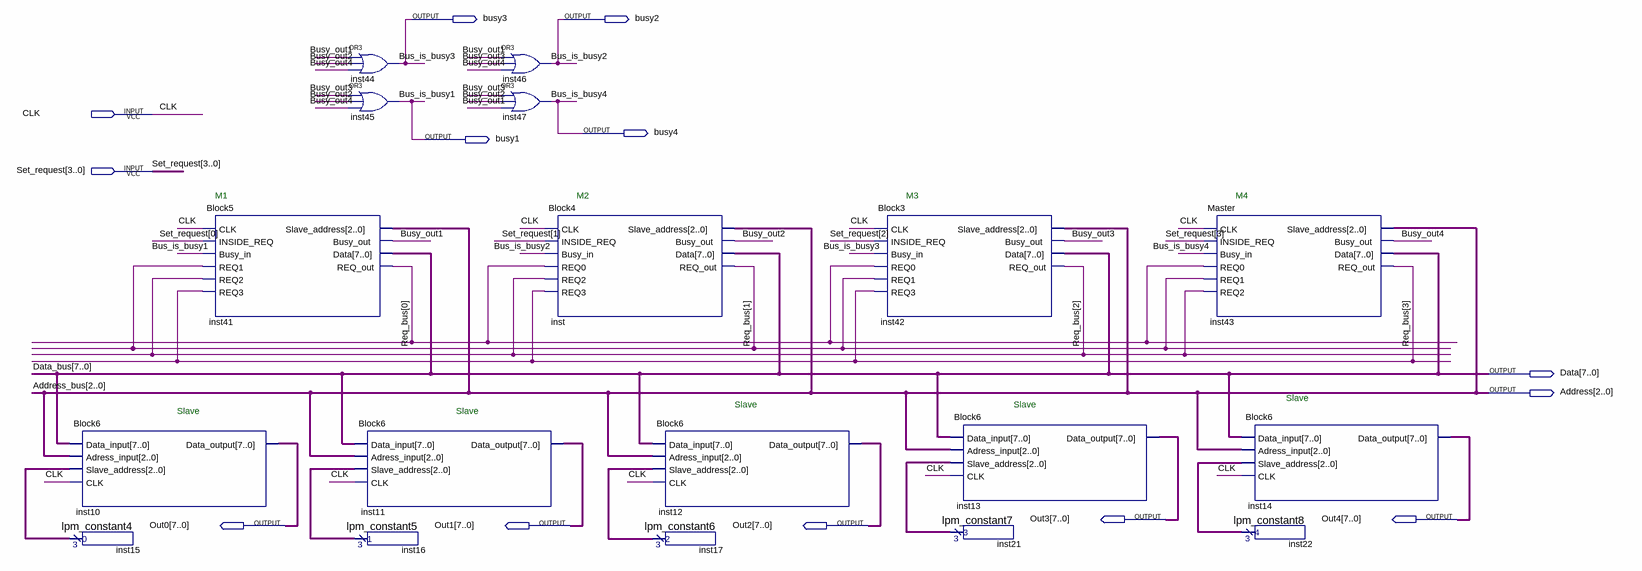
[diagram p0: schematic sheet]
// Quartus schematic Block7.bdf as structural Verilog: 18 symbols, 13 pins
module Block7 (
  input  CLK,
  input  [3:0] Set_request,
  output busy3,
  output busy2,
  output busy4,
  output busy1,
  output [7:0] Data,
  output [2:0] Address,
  output [7:0] Out3,
  output [7:0] Out4,
  output [7:0] Out0,
  output [7:0] Out1,
  output [7:0] Out2
);

  wire Busy_out1, Busy_out2, Busy_out3, Busy_out4;
  wire [2:0] inst15_result, inst16_result, inst17_result, inst21_result, inst22_result;
  wire [3:0] Req_bus;

  Block6 inst10 (
    .Data_input(Data), .Adress_input(Address), .Slave_address(inst15_result), .CLK(CLK), .Data_output(Out0));
  lpm_constant4 inst15 (.result(inst15_result));
  Block5 inst41 (
    .CLK(CLK), .INSIDE_REQ(Set_request[0]), .Busy_in(busy1), .REQ1(Req_bus[1]), .REQ2(Req_bus[2]),
    .REQ3(Req_bus[3]), .Slave_address(Address), .Busy_out(Busy_out1), .Data(Data), .REQ_out(Req_bus[0]));
  or inst44 (busy3, Busy_out1, Busy_out2, Busy_out4);
  or inst45 (busy1, Busy_out3, Busy_out2, Busy_out4);
  Block6 inst11 (
    .Data_input(Data), .Adress_input(Address), .Slave_address(inst16_result), .CLK(CLK), .Data_output(Out1));
  lpm_constant5 inst16 (.result(inst16_result));
  or inst46 (busy2, Busy_out1, Busy_out3, Busy_out4);
  or inst47 (busy4, Busy_out3, Busy_out2, Busy_out1);
  Block4 inst (
    .CLK(CLK), .INSIDE_REQ(Set_request[1]), .Busy_in(busy2), .REQ0(Req_bus[0]), .REQ2(Req_bus[2]),
    .REQ3(Req_bus[3]), .Slave_address(Address), .Busy_out(Busy_out2), .Data(Data), .REQ_out(Req_bus[1]));
  Block6 inst12 (
    .Data_input(Data), .Adress_input(Address), .Slave_address(inst17_result), .CLK(CLK), .Data_output(Out2));
  lpm_constant6 inst17 (.result(inst17_result));
  Block3 inst42 (
    .CLK(CLK), .INSIDE_REQ(Set_request[2]), .Busy_in(busy3), .REQ0(Req_bus[0]), .REQ1(Req_bus[1]),
    .REQ3(Req_bus[3]), .Slave_address(Address), .Busy_out(Busy_out3), .Data(Data), .REQ_out(Req_bus[2]));
  Block6 inst13 (
    .Data_input(Data), .Adress_input(Address), .Slave_address(inst21_result), .CLK(CLK), .Data_output(Out3));
  lpm_constant7 inst21 (.result(inst21_result));
  Master inst43 (
    .CLK(CLK), .INSIDE_REQ(Set_request[3]), .Busy_in(busy4), .REQ0(Req_bus[0]), .REQ1(Req_bus[1]),
    .REQ2(Req_bus[2]), .Slave_address(Address), .Busy_out(Busy_out4), .Data(Data), .REQ_out(Req_bus[3]));
  Block6 inst14 (
    .Data_input(Data), .Adress_input(Address), .Slave_address(inst22_result), .CLK(CLK), .Data_output(Out4));
  lpm_constant8 inst22 (.result(inst22_result));

  // Other names for the same wires on the sheet: Address_bus[2:0] = Address; Bus_is_busy4 = busy4;
  //   Bus_is_busy1 = busy1; Bus_is_busy2 = busy2; Bus_is_busy3 = busy3; Data_bus[7:0] = Data

  // Notes on the sheet:
  //   M1
  //   M2
  //   M3
  //   M4
  //   Slave
  //   Slave
  //   Slave
  //   Slave
  //   Slave
endmodule
